# EAGLE design Noisemaker Backpack (EAGLE 5.12)
PARTNO: CRCW060349K9FKEA

## Sheet 1 of 2
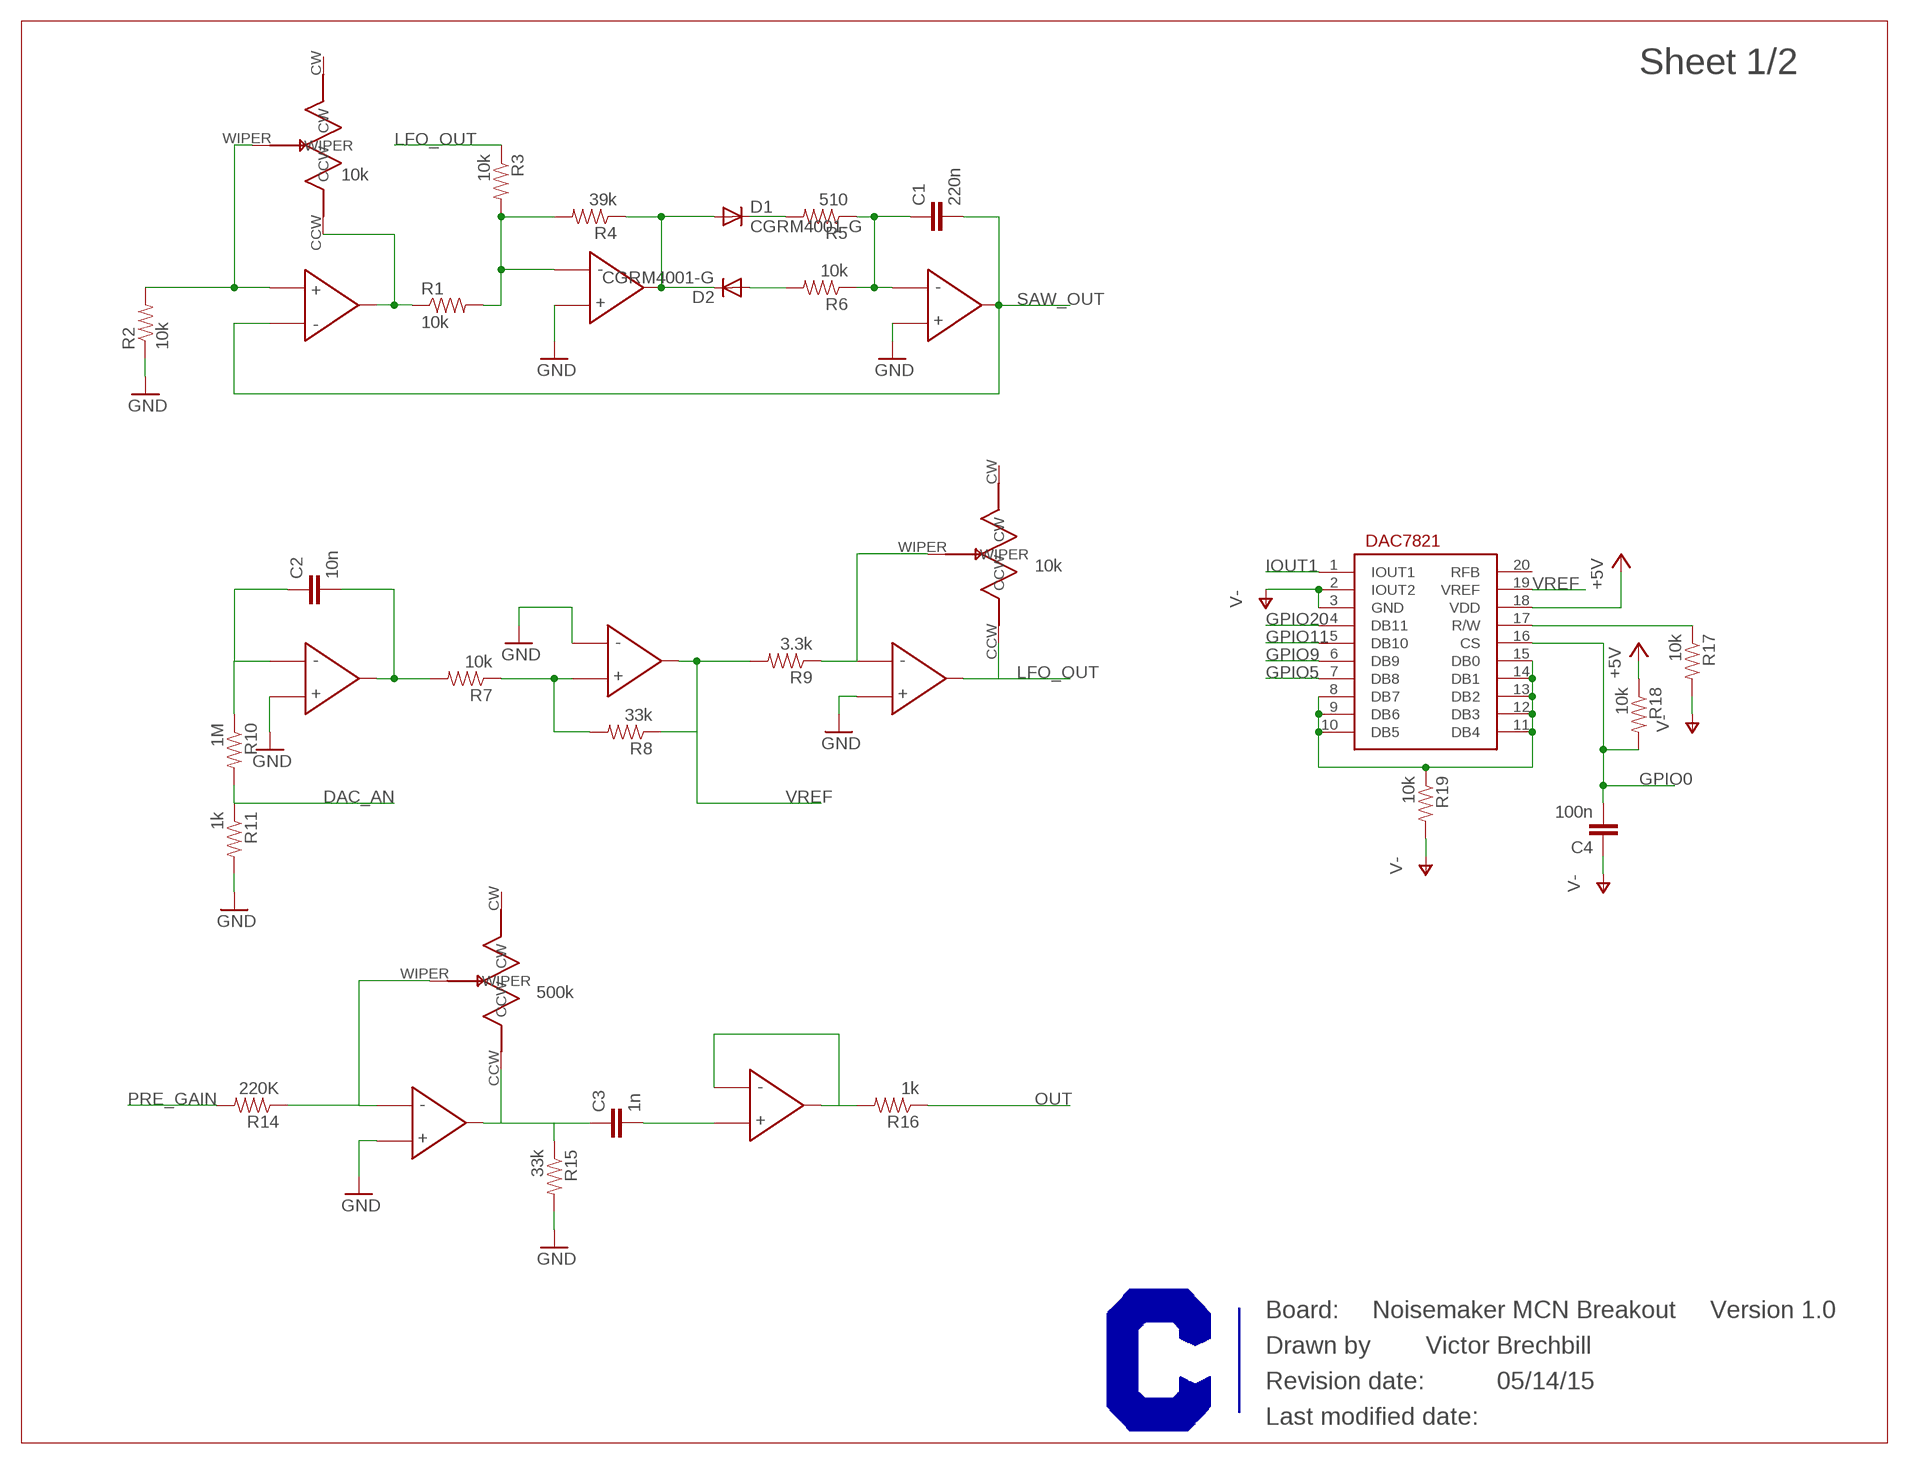
[diagram p0: schematic, sheet 1]

### Parts
C1  220n  CAP0603-CAP  [0603-CAP]
C2  10n  CAP0603-CAP  [0603-CAP]
C3  1n  CAP0603-CAP  [0603-CAP]
C4  100n  CAP0603-CAP  [0603-CAP]
D1  CGRM4001-G  [SOD-123_MINI-SMA]
D2  CGRM4001-G  [SOD-123_MINI-SMA]
IC1  TLV2764IPWR  [PW_(R-PDSO-G14)_(TSSOP-14)]
IC2  TLV2764IPWR  [PW_(R-PDSO-G14)_(TSSOP-14)]
IC3  DAC7821  [TSSOP20]
P1  3362P-103LF-ND  [3362P-103LF-ND_THROUGH_HOLE]
P2  3362P-103LF-ND  [3362P-103LF-ND_THROUGH_HOLE]
P3  3362P-103LF-ND  [3362P-103LF-ND_THROUGH_HOLE]
R1  10k  RESISTOR0603-RES  [0603-RES]
R2  10k  RESISTOR0603-RES  [0603-RES]
R3  10k  RESISTOR0603-RES  [0603-RES]
R4  39k  RESISTOR0603-RES  [0603-RES]
R5  510  RESISTOR0603-RES  [0603-RES]
R6  10k  RESISTOR0603-RES  [0603-RES]
R7  10k  RESISTOR0603-RES  [0603-RES]
R8  33k  RESISTOR0603-RES  [0603-RES]
R9  3.3k  RESISTOR0603-RES  [0603-RES]
R10  1M  RESISTOR0603-RES  [0603-RES]
R11  1k  RESISTOR0603-RES  [0603-RES]
R14  220K  RESISTOR0603-RES  [0603-RES]
R15  33k  RESISTOR0603-RES  [0603-RES]
R16  1k  RESISTOR0603-RES  [0603-RES]
R17  10k  RESISTOR0603-RES  [0603-RES]
R18  10k  RESISTOR0603-RES  [0603-RES]
R19  10k  RESISTOR0603-RES  [0603-RES]

### Nets
+5V: IC3.18(VDD) R18.1 ; also sheet 2
DAC_AN: R10.2 R11.1 ; also sheet 2
GPIO0: C4.2 IC3.16(CS) R18.2 ; also sheet 2
GPIO5: IC3.7(DB8) ; also sheet 2
GPIO9: IC3.6(DB9) ; also sheet 2
GPIO11: IC3.5(DB10) ; also sheet 2
GPIO20: IC3.4(DB11) ; also sheet 2
IOUT1: IC3.1(IOUT1) ; also sheet 2
LFO_OUT: IC1.14(OUT) P2.CCW R3.1
N$1: IC1.6(IN-) R1.2 R3.2 R4.2
N$2: C2.2 IC2.1(OUT) R7.2
N$3: IC1.1(OUT) P1.CCW R1.1
N$4: IC1.3(IN+) P1.WIPER R2.2
N$5: D1.A D2.C IC1.7(OUT) R4.1
N$6: D2.A R6.2
N$7: D1.C R5.2
N$8: C1.1 IC1.9(IN-) R5.1 R6.1
N$9: C2.1 IC2.2(IN-) R10.1
N$10: IC2.5(IN+) R7.1 R8.2
N$11: IC1.13(IN-) P2.WIPER R9.1
N$12: C3.1 IC2.8(OUT) P3.CCW R15.1
N$13: IC2.9(IN-) P3.WIPER R14.1
N$14: IC2.13(IN-) IC2.14(OUT) R16.2
N$15: C3.2 IC2.12(IN+)
N$16: IC3.17(R/W) R17.1
N$17: IC3.8(DB7) IC3.9(DB6) IC3.10(DB5) IC3.11(DB4) IC3.12(DB3) IC3.13(DB2) IC3.14(DB1) IC3.15(DB0) R19.1
N$18: IC1.5(IN+) IC1.10(IN+) IC1.12(IN+) IC2.3(IN+) IC2.6(IN-) IC2.10(IN+) R2.1 R11.2 R15.2 ; supply symbol labelled GND ; also sheet 2
OUT: R16.1 ; also sheet 2
PRE_GAIN: R14.2 ; also sheet 2
SAW_OUT: C1.2 IC1.2(IN-) IC1.8(OUT) ; also sheet 2
V-: C4.1 IC3.2(IOUT2) IC3.3(GND) R17.2 R19.2 ; also sheet 2
VREF: IC2.7(OUT) IC3.19(VREF) R8.1 R9.2
Unconnected: IC3.20(RFB) P1.CW P2.CW P3.CW

### Notes on the sheet
- 10k
- 10k
- 500k
- Noisemaker MCN Breakout | Version 1.0
- Victor Brechbill
- 05/14/15

## Sheet 2 of 2
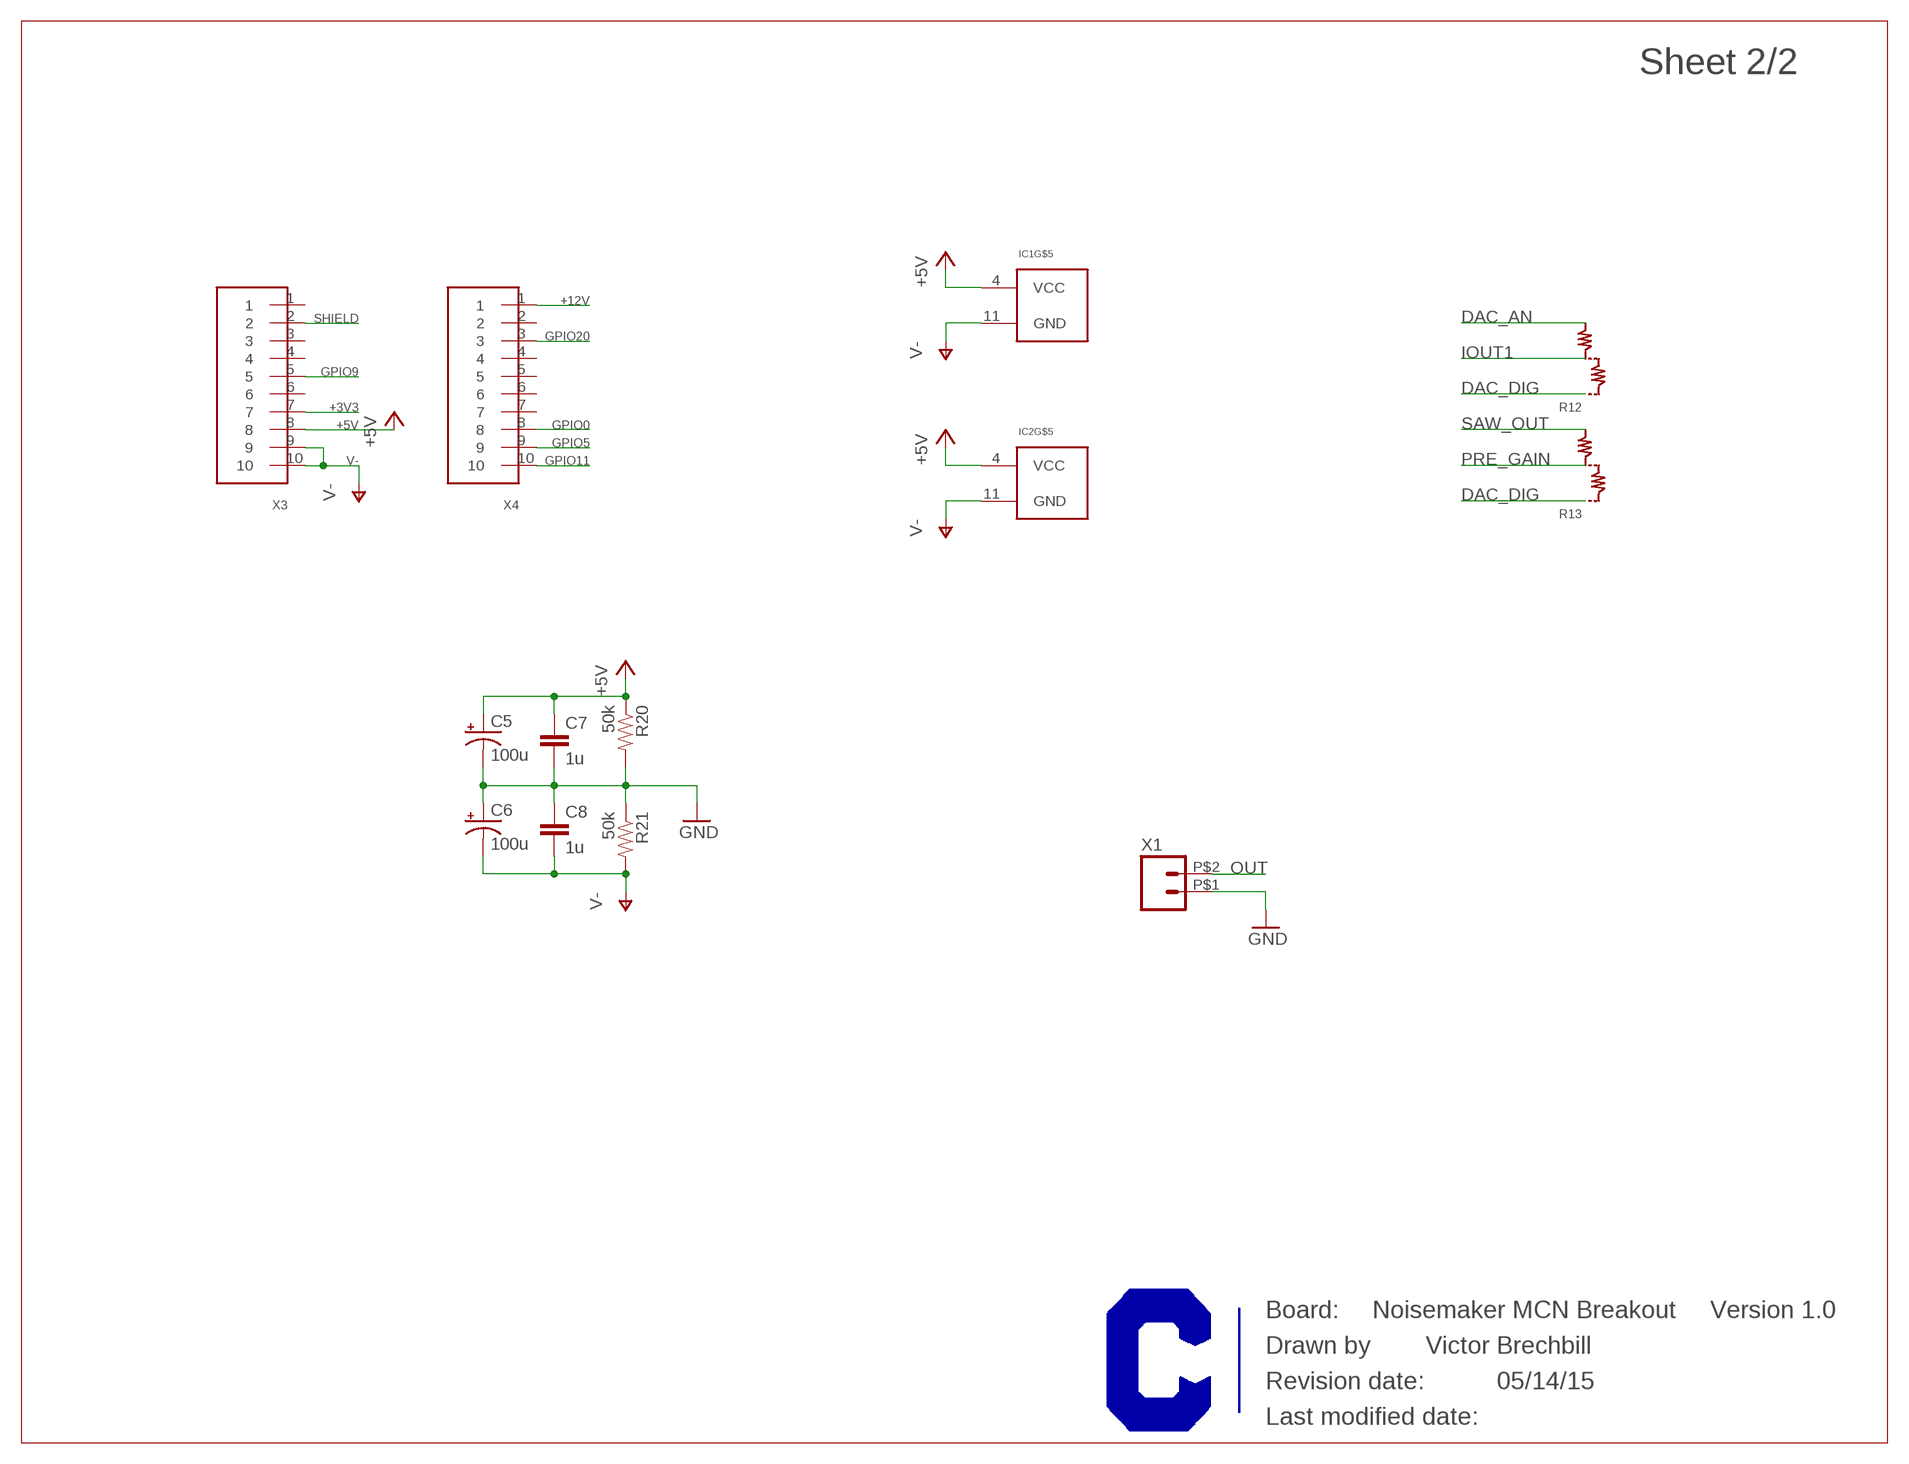
[diagram p1: schematic, sheet 2]

### Parts
C5  100u  CPOL-USE2.5-7  [E2,5-7]
C6  100u  CPOL-USE2.5-7  [E2,5-7]
C7  1u  CAP0603-CAP  [0603-CAP]
C8  1u  CAP0603-CAP  [0603-CAP]
R12  0402-JUMPER-3WAY-0603  [0603-JUMPER-3WAY]
R13  0402-JUMPER-3WAY-0603  [0603-JUMPER-3WAY]
R20  50k  RESISTOR0603-RES  [0603-RES]
R21  50k  RESISTOR0603-RES  [0603-RES]
X1  5MM_HEADER-2  [2POS-5MM]
X3  MALE-1X10-0.05"-PCB-VERT  [MA0.05"-1X10]
X4  MALE-1X10-0.05"-PCB-VERT  [MA0.05"-1X10]

### Nets
+3V3: X3.7
+5V: C5.+ C7.1 IC1.4(VCC) IC2.4(VCC) R20.1 X3.8 ; also sheet 1
+12V: X4.1
DAC_AN: R12.B ; also sheet 1
DAC_DIG: R12.C R13.C
GPIO0: X4.8 ; also sheet 1
GPIO5: X4.9 ; also sheet 1
GPIO9: X3.5 ; also sheet 1
GPIO11: X4.10 ; also sheet 1
GPIO20: X4.3 ; also sheet 1
IOUT1: R12.A ; also sheet 1
N$18: C5.- C6.+ C7.2 C8.1 R20.2 R21.1 X1.P$1 ; supply symbol labelled GND ; also sheet 1
OUT: X1.P$2 ; also sheet 1
PRE_GAIN: R13.A ; also sheet 1
SAW_OUT: R13.B ; also sheet 1
SHIELD: X3.2
V-: C6.- C8.2 IC1.11(GND) IC2.11(GND) R21.2 X3.9 X3.10 ; also sheet 1
Unconnected: X3.1 X3.3 X3.4 X3.6 X4.2 X4.4 X4.5 X4.6 X4.7

### Notes on the sheet
- Noisemaker MCN Breakout | Version 1.0
- Victor Brechbill
- 05/14/15

## Library data of the parts
C1-C4 C7 C8 = SparkFun:CAP: Capacitor Standard 0603 ceramic capacitor, and 0.1" leaded capacitor.
C5 C6 = rcl:CPOL-US: POLARIZED CAPACITOR, American symbol
D1 D2 = diode:CGRM400*-G: Molded plasitc,JEDEC SOD-123/Mini SMA Source: Comchip CGRM4001-G.pdf
IC1 IC2 = TI:TLV2764: TLV2764 - Micropower, Rail-to-Rail Input/Output Op-Amps with Shutdown Datasheet: http://www.ti.com/lit/ds/symlink/tlv2764.pdf; PARTNO: TLV2764IPWR
IC3 = TI:DAC7821: TI DAC 7821 Package: TSSOP-20 Newark: http://www.newark.com/texas-instruments/dac7821ipw/digital-to-analog-converter-dac/dp/80K1419 Datasheet: http://www.ti.com/lit/ds/symlink/dac7821.pdf
P1-P3 = Bourns:3362P-103LF-ND: 10 K Trimpot, 1 Turn
R1-R11 R14-R21 = SparkFun:RESISTOR: Resistor Basic schematic elements and footprints for 0603, 1206, and PTH resistors.
R12 R13 = Passives:0402-JUMPER-3WAY: A 3-way solder jumper in 0402 size.
X1 = Phoenix Contact:5MM_HEADER-2
X3 X4 = Pin headers:MALE-1X10: Male pin header, 1 row, 10 pins; PARTNO: BD020-10-A-J-0350-0300-L-G

## Board
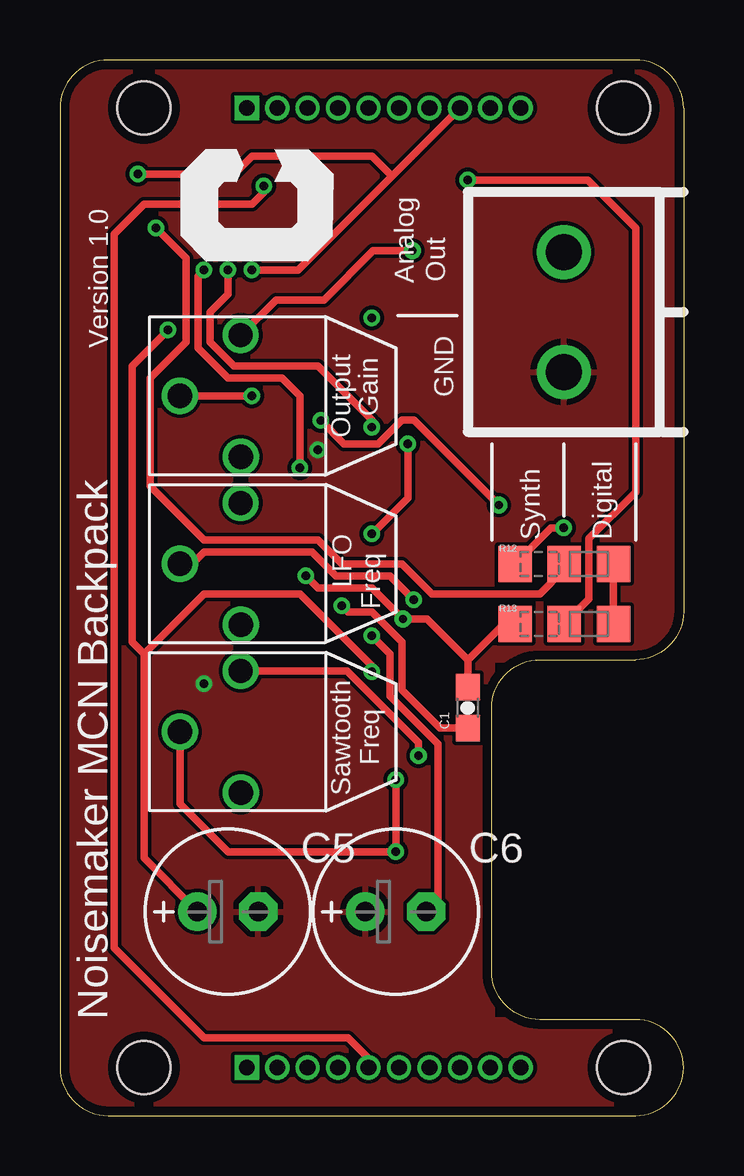
[diagram p2: board, top side]
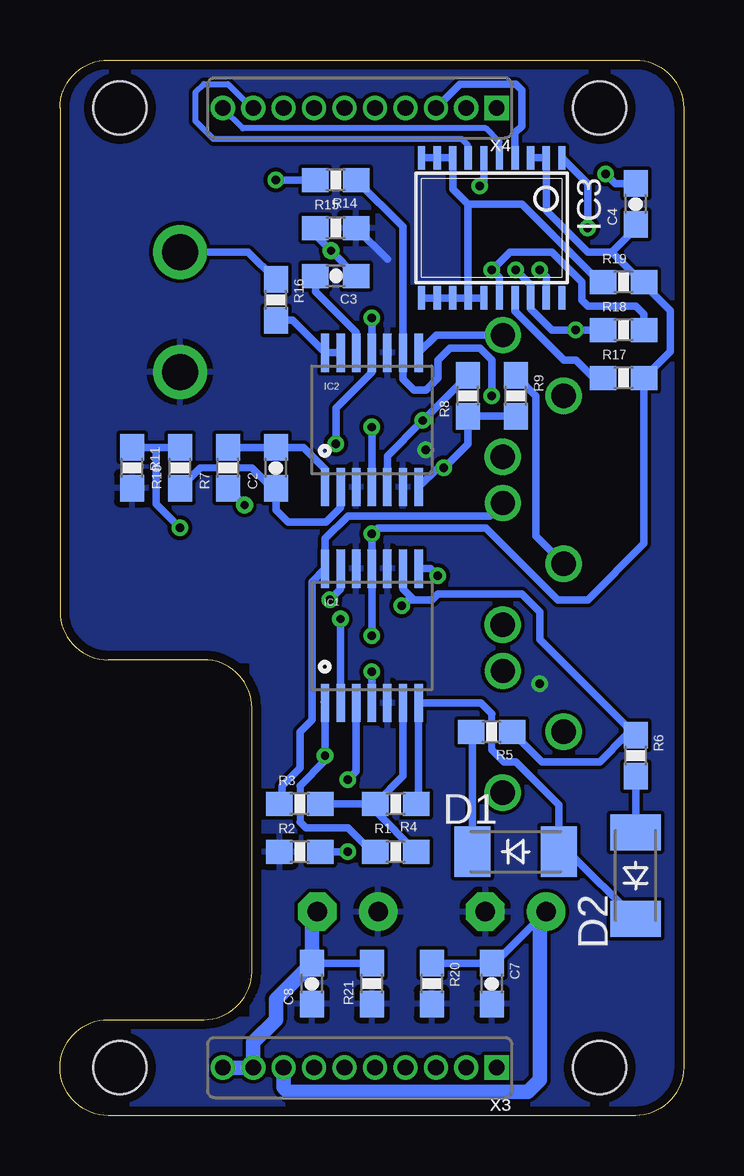
[diagram p3: board, bottom side, seen from below]

Size 26 x 44 mm. Coordinates in mm from the lower left corner, seen from the top.
Outline: 26,42 arc90 24,44 2,44 arc90 0,42 0,2 arc90 2,0 24,0 arc90 26,2 arc90 24,4 20,4 arc-90 18,6 18,17 arc-90 20,19 24,19 arc90 26,21 26,42
Copper layers (1*16): Top 0.0356mm / dielectric 1.5011mm / Bottom 0.0356mm
Design rules "OSH Park 2-layer": minimum track width 6mil, minimum drill 13mil, track to track 6mil, track to pad 6mil, pad to pad 6mil, via to via 6mil, smd to smd 6mil, copper to edge 15mil, drill to drill 6mil, minimum pad ring 7mil, minimum via ring 7mil, stop-mask expansion 4mil, vias tented up to drill 25mil, thermal gap 10mil
Holes 2.2 mm at 3.5,2 23.5,2 23.5,42 3.5,42

### Footprints (pad centres in the part's own frame; a part is rotated, then mirrored left to right if it is on the bottom)
0603-CAP = smd 1.1 x 1: 1 -0.85,0; 2 0.85,0
E2,5-7 = drill 0.813 pad 1.6 round: + -1.27,0 | drill 0.813 pad 1.6 octagon: - 1.27,0
SOD-123_MINI-SMA = smd 1.5 x 2.1: A 1.8,0; C -1.8,0
PW_(R-PDSO-G14)_(TSSOP-14) = smd 0.35 x 1.6: 1 -1.95,-2.8; 2 -1.3,-2.8; 3 -0.65,-2.8; 4 0,-2.8; 5 0.65,-2.8; 6 1.3,-2.8; 7 1.95,-2.8; 8 1.95,2.8; 9 1.3,2.8; 10 0.65,2.8; 11 0,2.8; 12 -0.65,2.8; 13 -1.3,2.8; 14 -1.95,2.8
TSSOP20 = smd 0.305 x 0.991: 1 -2.925,-2.918; 2 -2.275,-2.918; 3 -1.625,-2.918; 4 -0.975,-2.918; 5 -0.325,-2.918; 6 0.325,-2.918; 7 0.975,-2.918; 8 1.625,-2.918; 9 2.275,-2.918; 10 2.925,-2.918; 11 2.925,2.918; 12 2.275,2.918; 13 1.625,2.918; 14 0.975,2.918; 15 0.325,2.918; 16 -0.325,2.918; 17 -0.975,2.918; 18 -1.625,2.918; 19 -2.275,2.918; 20 -2.925,2.918
3362P-103LF-ND_THROUGH_HOLE = drill 1 round: CCW -2.54,2.54 | drill 1.016 round: CW 2.54,2.54; WIPER 0,0
0603-RES = smd 1.1 x 1: 1 -0.85,0; 2 0.85,0
0603-JUMPER-3WAY = smd 1.4 x 1.5: A 1.025,0; B -1.025,0; C 3.075,0
2POS-5MM = drill 1.5 round: P$1 0,0; P$2 5,0
MA0.05"-1X10 = drill 0.65 pad 1.016 square: 1 -5.715,0 | drill 0.65 pad 1.016 round: 2 -4.445,0; 3 -3.175,0; 4 -1.905,0; 5 -0.635,0; 6 0.635,0; 7 1.905,0; 8 3.175,0; 9 4.445,0; 10 5.715,0

### Placement (x,y rotation side)
C1  17,17 90 top
C2  17,27 90 bottom
C3  14.5,35 180 bottom
C4  2,38 90 bottom
C5  7,8.5 0 top
C6  14,8.5 0 top
C7  8,5.5 270 bottom
C8  15.5,5.5 90 bottom
D1  7,11 0 bottom
D2  2,10 90 bottom
IC1  13,20 0 bottom
IC2  13,29 0 bottom
IC3  8,37 180 bottom
P1  5,16 270 top
P2  5,23 270 top
P3  5,30 270 top
R1  12,11 0 bottom
R2  16,11 0 bottom
R3  16,13 0 bottom
R4  12,13 180 bottom
R5  8,16 180 bottom
R6  2,15 270 bottom
R7  19,27 90 bottom
R8  9,30 90 bottom
R9  7,30 270 bottom
R10  21,27 90 bottom
R11  23,27 270 bottom
R12  20,23 0 top
R13  20,20.5 0 top
R14  14.5,39 180 bottom
R15  14.5,37 0 bottom
R16  17,34 270 bottom
R17  2.5,30.75 0 bottom
R18  2.5,32.75 0 bottom
R19  2.5,34.75 0 bottom
R20  10.5,5.5 270 bottom
R21  13,5.5 90 bottom
X1  21,31 90 top
X3  13.5,2 180 bottom
X4  13.5,42 180 bottom

### Tracks (layer width: path | path; a pad name or v marks a point on that pad's centre or on a via)
+5V  (via drill 0.34)
  Top 0.305: v13,18.5 13,18.75 10,21.75 6,21.75 3.5,19.25 | 3.5,19.25 3.5,10.73 C5.+ | 3.5,19.25 3,19.75 3,31.25 v4.5,32.75 | v7,35.25 7,34.25 6.25,33.5 6.25,32.25 7.25,31.25 10.75,31.25 13,29 v13,28.7
  Bottom 0.305: R20.1 C7.1 7.88,6.35 C5.+ | v13,18.5 IC1.4 | R18.1 v4.5,32.75 5.5,32.75 6.38,33.62 IC3.18 6.38,34.62 v7,35.25 | v13,28.7 IC2.4
  Bottom 0.61: X3.8 16.68,1.18 16.5,1 6.5,1 6,1.5 6,8.23 C5.+
DAC_AN  (via drill 0.34)
  Top 0.305: R12.B 20.48,24.5 v21,24.5
  Bottom 0.305: 22,27.85 R10.2 | 22,27.85 R11.1 | v21,24.5 22,25.5 22,27.85
DAC_DIG
  Top 0.305: R13.C R12.C
GPIO0  (via drill 0.34)
  Top 0.305: 13.84,39.16 9.93,35.25 v8,35.25 | 13.84,39.16 X4.8 | v3.25,39.25 7.25,39.25 8,40 13,40 13.84,39.16
  Bottom 0.305: IC3.16 7.67,34.92 v8,35.25 7.25,36 5.5,36 4.25,34.75 4.25,34 4,33.75 2,33.75 1.65,33.4 R18.2 | C4.2 2.85,38.85 v3.25,39.25
GPIO5
  Bottom 0.25: X4.9 18,42 19,43 20,43 20.35,42.65 20.35,41.45 19.6,40.7 9.25,40.7 8.97,40.42 IC3.7
GPIO9  (via drill 0.34)
  Top 0.305: X3.5 12.87,2.38 12,3.25 6,3.25 2.25,7 2.25,36.75 3.5,38 8,38 8.5,38.5 v8.5,38.75
  Bottom 0.305: v8.5,38.75 8.32,38.92 IC3.6
GPIO11
  Bottom 0.25: IC3.5 7.67,40.58 8.25,41.15 18.36,41.15 X4.10
GPIO20
  Bottom 0.305: X4.3 9.32,43 7,43 6.75,42.75 6.75,41.25 7.03,40.98 IC3.4
IOUT1  (via drill 0.34)
  Top 0.305: R12.A 21.02,22.77 20,21.75 15.5,21.75 14.25,23 11.75,23 10.75,24 6,24 3.75,26.25 3.75,30.75 5.25,32.25 5.25,35.75 v4,37
  Bottom 0.305: v4,37 4,38.84 IC3.1
LFO_OUT
  Bottom 0.305: R3.1 16.75,13.1 16.75,13.75 16,14.5 16,16 15.5,16.5 15.5,22.25 IC1.14 14.95,24.05 14,25 8.08,25 P2.CCW
N$1
  Bottom 0.305: IC1.6 11.7,14.15 R4.2 | R4.2 12.85,12.7 R1.2 | R4.2 R3.2
N$2
  Bottom 0.305: IC2.1 14.95,26.95 15.85,27.85 C2.2 R7.2
N$3  (via drill 0.34)
  Top 0.305: P1.CCW 11.96,18.54 14.95,15.55 v14.95,15
  Bottom 0.29: 16,13.75 16,12.25
  Bottom 0.305: R1.1 13,11 14,12 15.75,12 16,12.25 | 16,13.75 14.95,14.8 v14.95,15 14.95,15.5 IC1.1 15,17.25
N$4  (via drill 0.34)
  Top 0.305: v14,14 v14,11 7,11 5,13 P1.WIPER
  Bottom 0.305: v14,11 R2.2 | v14,14 13.65,14.35 IC1.3
N$5
  Bottom 0.29: 8,15.25 8,16.75
  Bottom 0.305: D2.C 4.8,11 D1.A 5.2,12.95 7,14.75 7.5,14.75 8,15.25 | 8,16.75 8.45,17.2 IC1.7 11.05,13.1 R4.1
N$6
  Bottom 0.305: D2.A R6.2
N$7
  Bottom 0.305: D1.C 8.8,15.95 R5.2
N$8  (via drill 0.34)
  Top 0.305: C1.1 15.85,16.15 14.25,17.75 14.25,19.75 13,21 12,21 v11.75,21.25
  Bottom 0.305: 11.25,21.5 11.7,21.95 IC1.9 | R5.1 5.9,14.75 3.5,14.75 2.4,15.85 R6.1 6,19.85 6,21 6.75,21.75 10.25,21.75 10.5,21.5 11.25,21.5 | v11.75,21.25 11.5,21.5 11.25,21.5
N$9
  Bottom 0.29: 18,27 20.15,27
  Bottom 0.305: 20.15,27 R10.1 | 18,27 17.15,26.15 C2.1 17,25.25 16.5,24.75 14.9,24.75 14.3,25.35 IC2.2
N$10  (via drill 0.34)
  Top 0.305: v18.3,25.45 14.75,29 14.25,29 13.25,28 11.85,28 v10.88,28.98
  Bottom 0.305: IC2.5 12.35,27.5 10.93,28.93 v10.88,28.98 R8.2 | v18.3,25.45 R7.1
N$11  (via drill 0.34)
  Top 0.305: P2.WIPER 5.5,23 6,23.5 10.5,23.5 11.5,22.5 13.75,22.5 v14.75,21.5
  Bottom 0.305: IC1.13 14.3,21.95 v14.75,21.5 | R9.1 6.15,30 6.15,24.15 P2.WIPER
N$12  (via drill 0.34)
  Top 0.305: P3.CCW 9,34 11,34 13.05,36.05 v14.7,36.05
  Bottom 0.305: P3.CCW 10.31,32.54 IC2.8 | C3.1 v14.7,36.05 15.35,36.7 R15.1
N$13  (via drill 0.34)
  Top 0.305: P3.WIPER v8,30
  Bottom 0.305: R14.1 11.7,37.05 IC2.9 11.7,30.7 11.25,30.25 10.75,30.25 10.25,30.75 10.25,31.5 9.75,32 8.5,32 8,31.5 v8,30
N$14
  Bottom 0.305: IC2.13 IC2.14 16.3,33.15 R16.2
N$15
  Bottom 0.305: IC2.12 13.65,32.65 15.35,34.35 C3.2
N$16
  Bottom 0.305: IC3.17 7.03,33.52 5,31.5 4.5,31.5 3.75,30.75 R17.1
N$17
  Bottom 0.305: R19.1 3.5,34.75 6.75,38 9,38 | 9,38 9.62,38.62 IC3.8 IC3.9 IC3.10 | IC3.11 IC3.12 IC3.13 IC3.14 | IC3.14 IC3.15 | IC3.14 9,34.11 9,38
N$18  (via drill 0.34)
  Bottom 0.305: 12.35,35.7 R15.2
  other vias: 6,18 10.75,27.75
  pour Top: 0,44 26,44 26,19 18,19 18,4 26,4 26,3 26,0 0,0
  pour Bottom: 0,44 26,44 26,19 18,19 18,4 26,4 26,0 0,0
OUT
  Bottom 0.305: R16.1 18.15,36 X1.P$2
PRE_GAIN  (via drill 0.34)
  Top 0.305: v17,39 22,39 24,37 24,26.2 24,26 22.05,24.05 22.05,21.52 R13.A
  Bottom 0.305: v17,39 R14.2
SAW_OUT  (via drill 0.34)
  Top 0.305: 17,19 C1.2 | 17,19 18.5,20.5 R13.B | 17,19 15.3,20.7 v14.3,20.7 14,21 13,22 10.75,22 v10.25,22.5
  Bottom 0.305: v10.25,22.5 10.55,22.8 IC1.8 | IC1.2 v14.3,20.7
V-  (via drill 0.34)
  Top 0.305: v13,20 13.75,19.25 13.75,17.5 15.75,15.5 15.75,8.98 C6.- | v13,24.25 14.5,25.75 v14.5,28
  Bottom 0.305: R21.2 C8.2 | v13,20 IC1.11 v13,24.25 12.75,24.5 8.25,24.5 5.25,21.5 4,21.5 1.65,23.85 R17.2 0.55,31.85 0.55,33.55 1.65,34.65 R19.2 1.75,34.75 3,36 | v13,33.25 IC2.11 13,31 14.5,29.5 v14.5,28 | IC3.3 IC3.2 5.72,37.73 4,36 3,36 | C4.1 2,37 3,36
  Bottom 0.61: X3.10 X3.9 17.95,3.06 17,4 17,4.85 C8.2 15.5,8.27 C6.-
VREF  (via drill 0.34)
  Top 0.305: v10,27 10,30 9.25,30.75 7,30.75 5.75,32 5.75,35 v6,35.25
  Bottom 0.305: IC3.19 5.72,34.98 v6,35.25 | IC2.7 10.25,27 v10,27 9,28 R8.1 | R9.2 R8.1 | R8.1 8.15,29.15

### Text on the board
tPlace: Analog | Out | Version 1.0 | GND | Gain | Output | Synth | Digital | LFO | Freq | Freq | Sawtooth | Noisemaker MCN Backpack